# Altium schematic sheet PSU_tracer.schdoc
size 277 x 198 mm
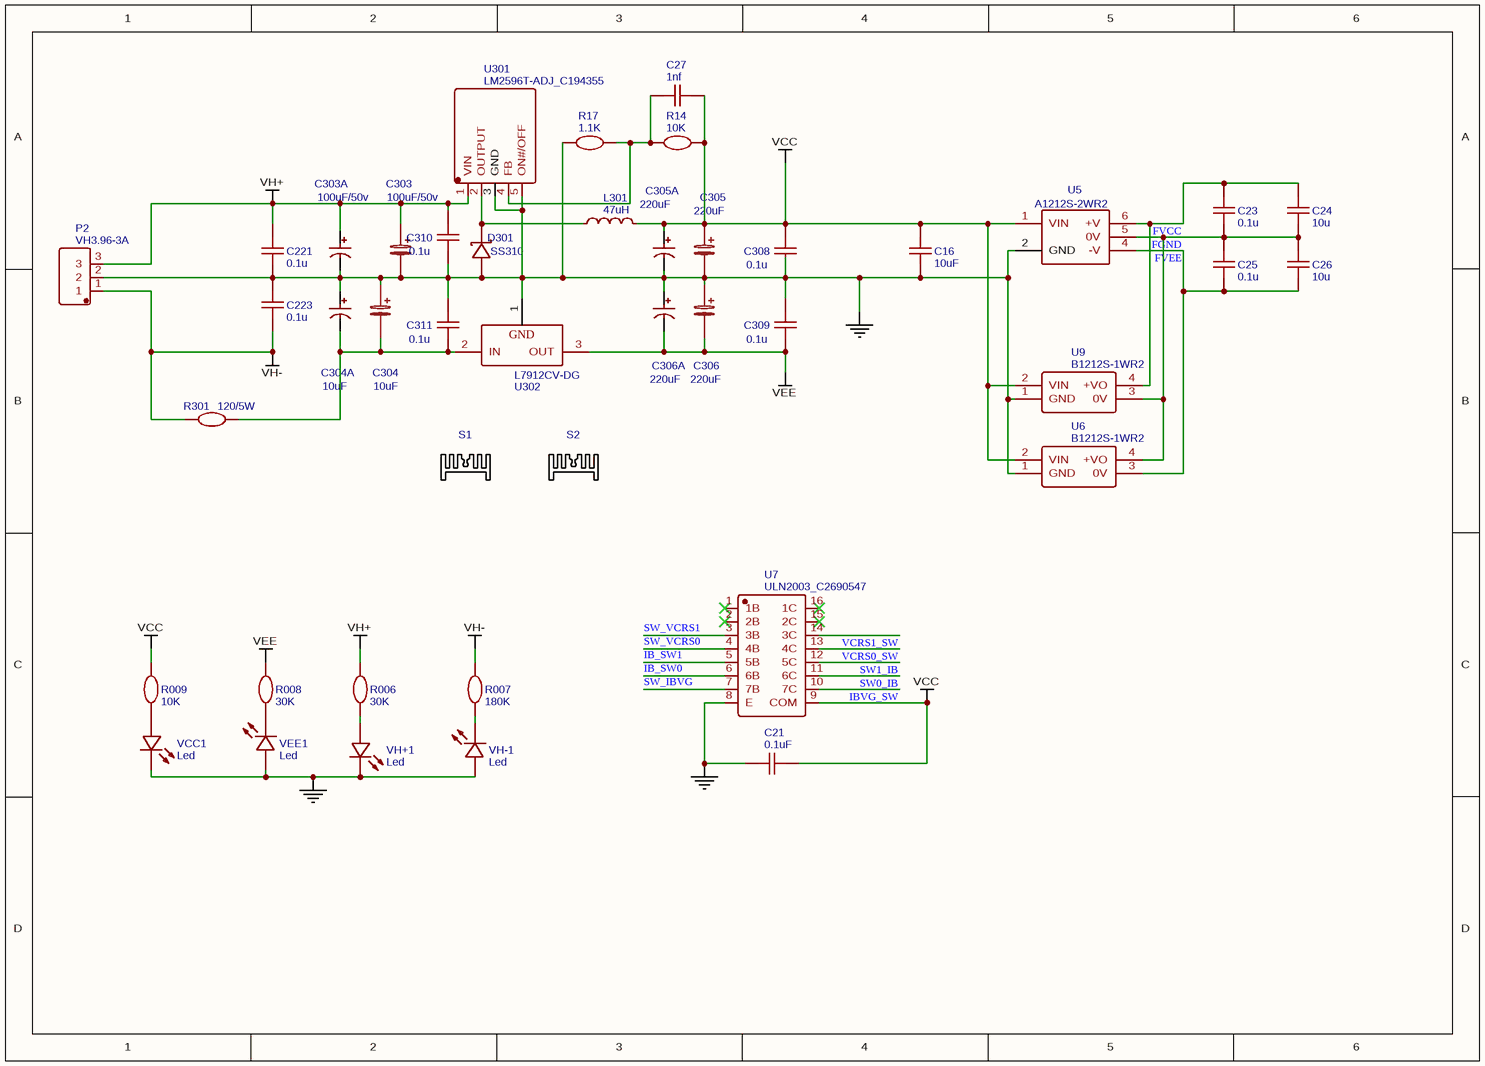
[diagram p0: PSU_tracer.schdoc]

## Parts
C16  10uF  [C0805]
C21  0.1uF  [C0805]
C23  0.1u  [C0805]
C24  10u  [C0805]
C25  0.1u  [C0805]
C26  10u  [C0805]
C27  1nf  [C0805]
C221  0.1u  [RAD-0.2]
C223  0.1u  [RAD-0.2]
C303  100uF/50v  [CAP-TH_BD8.0-P3.50-D1.0-FD]
C303A  100uF/50v  [CAP-TH_BD8.0-P2.50-D1.0-FD]
C304  10uF  [CAP-TH_BD8.0-P3.50-D1.0-FD]
C304A  10uF  [CAP-TH_BD8.0-P2.50-D1.0-FD]
C305  220uF  [CAP-TH BD8.0-P3.50-D1.0-FD]
C305A  220uF  [CAP-TH_BD8.0-P2.50-D1.0-FD]
C306  220uF  [CAP-TH BD8.0-P3.50-D1.0-FD]
C306A  220uF  [CAP-TH_BD8.0-P2.50-D1.0-FD]
C308  0.1u  [C0805]
C309  0.1u  [C0805]
C310  0.1u  [C0805]
C311  0.1u  [C0805]
D301  SS310  [SMA_L4.3-W2.6-LS5.2-FD]
L301  47uH  [IND-SMD_L11.5-W10.5_MWSA1004]
P2  VH3.96-3A  [CONN-TH_3P-P3.96_VH3.96-3A]
R006  30K  [R0805_NEW]
R007  180K  [R0805_NEW]
R008  30K  [R0805_NEW]
R009  10K  [R0805_NEW]
R14  10K  [R0805_NEW]
R17  1.1K  [R0805_NEW]
R301  120/5W  [R-AXIAL-1.2- 5W]
S1  TO-220中点焊  [HEATSINK-TH_L23.5-W16.0-P18.0_XSD2156-067]  (value not drawn)
S2  TO-220中点焊  [HEATSINK-TH_L23.5-W16.0-P18.0_XSD2156-067]  (value not drawn)
U5  A1212S-2WR2  [PWRM-TH_A1212S-2WR2]
U6  B1212S-1WR2  [PWRM-TH_BXXXXS-1W]
U7  ULN2003_C2690547  [SOP-16_L10.0-W3.9-P1.27-LS6.0-BL]
U9  B1212S-1WR2  [PWRM-TH_BXXXXS-1W]
U301  LM2596T-ADJ_C194355  [TO-220-5L_L10.2-W4.5-P1.71-L]
U302  L7912CV-DG  [TO-220-3_L10.0-W4.5-P2.54-L]
VCC1  Led  [LED-TH_BD4.0-P2.54-FD]
VEE1  Led  [LED-TH_BD4.0-P2.54-FD]
VH+1  Led  [LED-TH_BD4.0-P2.54-FD]
VH-1  Led  [LED-TH_BD4.0-P2.54-FD]

## Nets
GND: C16.1 C21.2 C221.1 C223.2 C303.2 C303A.2 C304.1 C304A.1 C305.2 C305A.2 C306.1 C306A.1 C308.1 C309.2 C310.1 C311.2 D301.1(A) P2.2 R17.2 U5.2(GND) U6.1(GND) U7.8(E) U9.1(GND) U301.3(GND) U301.5(ON#/OFF) U302.1(GND) VCC1.2(K) VEE1.1(A) VH+1.2(K) VH-1.1(A)
VCC: C16.2 C21.1 C27.1 C305.1 C305A.1 C308.2 L301.2 R009.1 R14.2 U5.1(VIN) U6.2(VIN) U7.9(COM) U9.2(VIN)
VEE: C306.2 C306A.2 C309.1 R008.1 U302.3(OUT)
VH+: C221.2 C303.1 C303A.1 C310.2 P2.3 R006.1 U301.1(VIN)
VH-: C223.1 P2.1 R007.1 R301.1
FGND: C23.1 C24.1 C25.2 C26.2 U5.5(0V) U6.4(+VO) U9.3(0V)
FVCC: C23.2 C24.2 U5.6(+V) U9.4(+VO)
FVEE: C25.1 C26.1 U5.4(-V) U6.3(0V)
IB_SW0: U7.6(6B)
IB_SW1: U7.5(5B)
IBVG_SW: U7.10(7C)
SW0_IB: U7.11(6C)
SW1_IB: U7.12(5C)
SW_IBVG: U7.7(7B)
SW_VCRS0: U7.4(4B)
SW_VCRS1: U7.3(3B)
VCRS0_SW: U7.13(4C)
VCRS1_SW: U7.14(3C)
NetC27_2: C27.2 R14.1 R17.1 U301.4(FB)
NetC304_2: C304.2 C304A.2 C311.1 R301.2 U302.2(IN)
NetD301_2: D301.2(K) L301.1 U301.2(OUTPUT)
NetR006_2: R006.2 VH+1.1(A)
NetR007_2: R007.2 VH-1.2(K)
NetR008_2: R008.2 VEE1.2(K)
NetR009_2: R009.2 VCC1.1(A)

Not connected (* = marked no-connect by the designer): U7 1(1B)* 2(2B)* 15(2C)* 16(1C)*

## Library data of the parts
C16 = 10uF: nameAlias: Value(F); spicePre: C; spiceSymbolName: Cap_0805_US
C21 = 0.1uF: nameAlias: Value(F); spicePre: C; spiceSymbolName: Cap_0805_US
C23 C25 C221 C223 = 0.1u: nameAlias: Value(F); spicePre: C; spiceSymbolName: Cap_0805_US
C24 C26 = 10u: nameAlias: Value(F); spicePre: C; spiceSymbolName: Cap_0805_US
C27 = 1nf: nameAlias: Value(F); spicePre: C; spiceSymbolName: Cap_0805_US
C303 = 100uF/50v: nameAlias: Value(F); Contributor: LCEDA_Lib; spicePre: C; spiceSymbolName: C_Tan_SMD_A_EU
C303A = 100uF/50v: BOM_Manufacturer: ValuePro; BOM_Manufacturer Part: 100uF 16V 6.3*5; nameAlias: Capacitance; BOM_Supplier: LCSC; BOM_Supplier Part: C43804; spicePre: C; spiceSymbolName: 100uF 16V 6.3*5
C304 = 10uF: nameAlias: Value(F); Contributor: LCEDA_Lib; spicePre: C; spiceSymbolName: C_Tan_SMD_A_EU
C304A = 10uF: BOM_Manufacturer: ValuePro; BOM_Manufacturer Part: 100uF 16V 6.3*5; nameAlias: Capacitance; BOM_Supplier: LCSC; BOM_Supplier Part: C43804; spicePre: C; spiceSymbolName: 100uF 16V 6.3*5
C305 C306 = 220uF: nameAlias: Value(F); Contributor: LCEDA_Lib; spicePre: C; spiceSymbolName: C_Tan_SMD_A_EU
C305A C306A = 220uF: BOM_Manufacturer: ValuePro; BOM_Manufacturer Part: 100uF 16V 6.3*5; nameAlias: Capacitance; BOM_Supplier: LCSC; BOM_Supplier Part: C43804; spicePre: C; spiceSymbolName: 100uF 16V 6.3*5
C308-C311 = 0.1u: nameAlias: Value(F); Contributor: LCEDA_Lib; spicePre: C; spiceSymbolName: C_0201_US
D301 = SS310: BOM_Manufacturer Part: SS110; BOM_Manufacturer: MDD; SMT Type: Extend; BOM_Supplier: LCSC; image: //image.lceda.cn/szlcsc/C2482.jpg; BOM_Supplier Part: C2482; BOM_LCSC Assembly: Yes; spicePre: D; spiceSymbolName: SS110 COPY
L301 = 47uH: BOM_Manufacturer: COILMX; BOM_Manufacturer Part: MS1040-470M; nameAlias: Inductance; Contributor: LCSC; BOM_Supplier: LCSC; BOM_Supplier Part: C380057; spicePre: L; spiceSymbolName: MS1040-470M
P2 = VH3.96-3A: BOM_Manufacturer: BOOMELE; spicePre: X; BOM_Supplier: LCSC; BOM_Manufacturer Part: VH3.96-3A; image: //image.lceda.cn/szlcsc/C20547.jpg; BOM_Supplier Part: C20547; spiceSymbolName: VH3.96-3A
R006 R008 = 30K: nameAlias: Value(Ω); spicePre: R; spiceSymbolName: Res_0805(1/8W)_EU
R007 = 180K: nameAlias: Value(Ω); spicePre: R; spiceSymbolName: Res_0805(1/8W)_EU
R009 R14 = 10K: nameAlias: Value(Ω); spicePre: R; spiceSymbolName: Res_0805(1/8W)_EU
R17 = 1.1K: nameAlias: Value(Ω); spicePre: R; spiceSymbolName: Res_0805(1/8W)_EU
R301 = 120/5W: nameAlias: Value(Ω); spicePre: R; spiceSymbolName: Res_AXIAL-0.6(1W)_EU
S1 S2 = TO-220中点焊: BOM_Manufacturer Part: TO-220散热片25*15*10; BOM_Mounted: Yes; 贡献者: Mxi; Contributor: PowerHGC; BOM_Supplier: EasyEDA; spicePre: S; spiceSymbolName: TO-220中点焊
U5 = A1212S-2WR2: BOM_Manufacturer: MORNSUN; BOM_Supplier: LCSC; BOM_Manufacturer Part: A1212S-2WR2; BOM_Supplier Part: C41496; BOM_JLCPCB Part Class: Extended Part; spicePre: U; spiceSymbolName: A1212S-2WR2
U6 U9 = B1212S-1WR2: BOM_Manufacturer: MORNSUN; Contributor: yuanshuo; BOM_Supplier: LCSC; BOM_Manufacturer Part: B1212S-1WR2; BOM_Supplier Part: C114073; spicePre: U; spiceSymbolName: B1212S-1WR2
U7 = ULN2003_C2690547: BOM_Manufacturer: BL(上海贝岭); Contributor: LCSC; BOM_Supplier: LCSC; BOM_Supplier Part: C2690547; BOM_Manufacturer Part: ULN2003; BOM_JLCPCB Part Class: Extended Part; spicePre: U; spiceSymbolName: ULN2003_C2690547
U301 = LM2596T-ADJ_C194355: BOM_Manufacturer: HGSEMI; Contributor: LCSC; BOM_Supplier: LCSC; BOM_Supplier Part: C194355; BOM_Manufacturer Part: LM2596T-ADJ; BOM_JLCPCB Part Class: Extended Part; spicePre: U; spiceSymbolName: LM2596T-ADJ_C194355
U302 = L7912CV-DG: BOM_Manufacturer: STMicroelectronics; SMT Type: Extend; BOM_Supplier: LCSC; BOM_Manufacturer Part: L7912CV-DG; image: //image.lceda.cn/szlcsc/C3797.jpg; BOM_Supplier Part: C3797; BOM_JLCPCB SMD: Yes; spicePre: U; spiceSymbolName: L7912CV-DG
VCC1 VEE1 VH+1 VH-1 = Led: BOM_Manufacturer: TONYU; BOM_Manufacturer Part: DY-204URD/SN-A3(EL); Contributor: LCSC; BOM_Supplier: LCSC; BOM_Supplier Part: C396687; spicePre: L; spiceSymbolName: DY-204URD/SN-A3(EL)